# EAGLE schematic boilup_v2 (EAGLE 8.7.1)
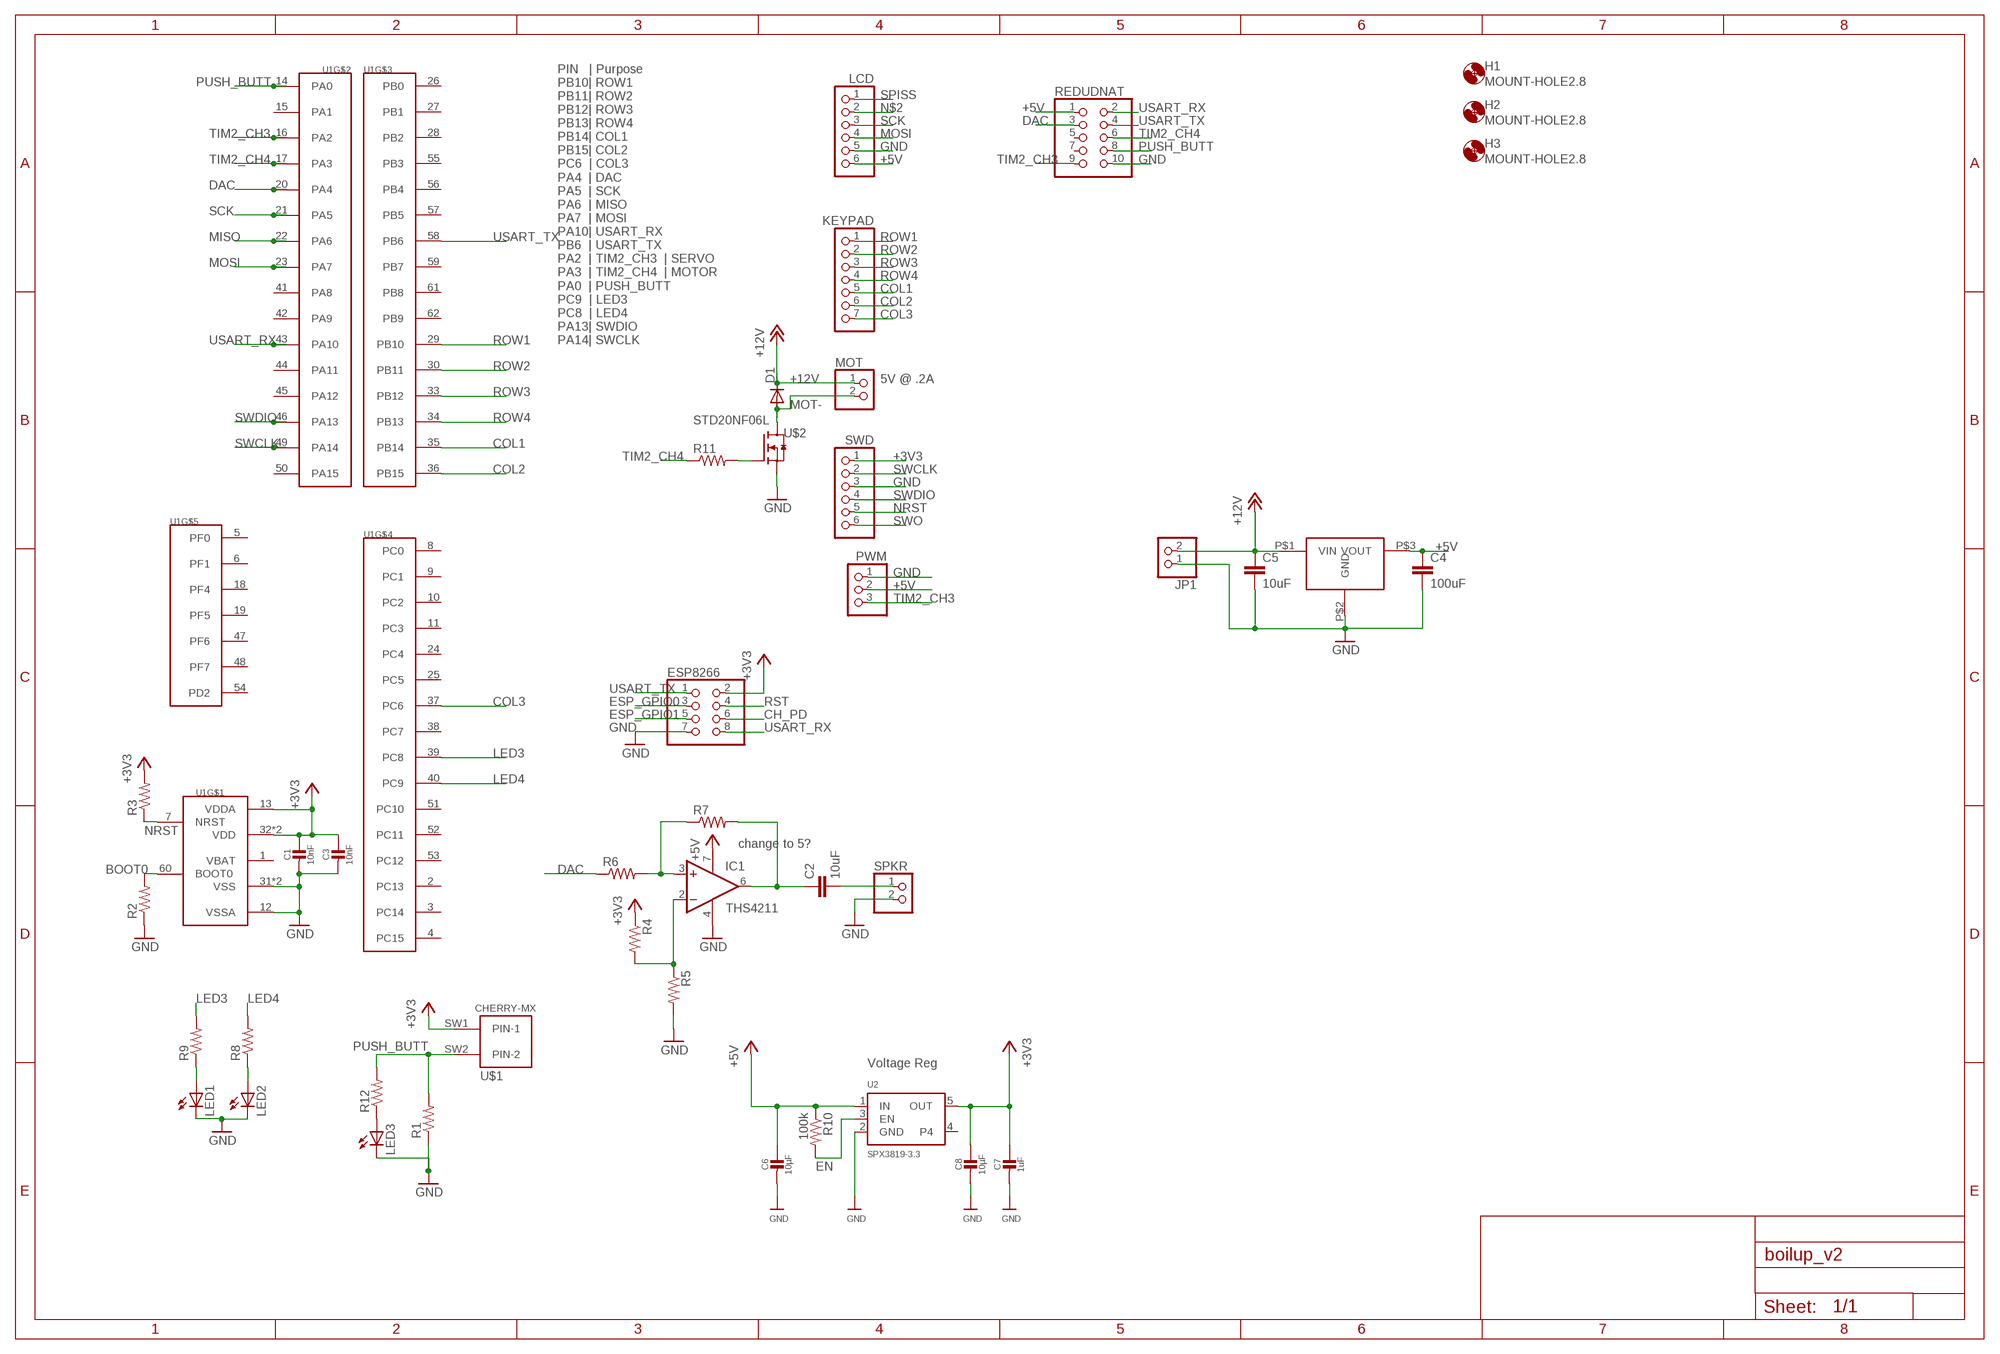
[diagram p0: schematic, sheet 1]

## Parts
C1  10nF  CAP_CERAMIC0805-NOOUTLINE  [0805-NO]
C2  10uF  C-EUC0603K  [C0603K]
C3  10nF  CAP_CERAMIC0805-NOOUTLINE  [0805-NO]
C4  100uF  C-EUC1210K  [C1210K]
C5  10uF  C-EUC0603K  [C0603K]
C6  10µF  CAP_CERAMIC0805-NOOUTLINE  [0805-NO]
C7  1uF  CAP_CERAMIC0603_NO  [0603-NO]
C8  10µF  CAP_CERAMIC0805-NOOUTLINE  [0805-NO]
D1  DIODE-DO-214AC  [DO-214AC]
ESP8266  PINHD-2X4  [2X04]
H1  MOUNT-HOLE2.8  [2,8]
H2  MOUNT-HOLE2.8  [2,8]
H3  MOUNT-HOLE2.8  [2,8]
IC1  THS4211  [S-PDSO-G08]
JP1  PINHD-1X2  [1X02]
KEYPAD  PINHD-1X7  [1X07]
LCD  PINHD-1X6  [1X06]
LED1  LEDSML0805  [SML0805]
LED2  LEDSML0805  [SML0805]
LED3  LEDSML0805  [SML0805]
MOT  PINHD-1X2  [1X02]
PWM  PINHD-1X3  [1X03]
R1  R-US_R0603  [R0603]
R2  R-US_R0603  [R0603]
R3  R-US_R0603  [R0603]
R4  R-US_R0603  [R0603]
R5  R-US_R0603  [R0603]
R6  R-US_R0603  [R0603]
R7  R-US_R0603  [R0603]
R8  R-US_R0603  [R0603]
R9  R-US_R0603  [R0603]
R10  100k  R-US_R0603  [R0603]
R11  R-US_R0603  [R0603]
R12  R-US_R0603  [R0603]
REDUDNAT  PINHD-2X5  [2X05]
SPKR  PINHD-1X2  [1X02]
SWD  PINHD-1X6  [1X06]
U1  STM32F0_LQFP64  [QFP50P1200X1200X160-64N]
U2  SPX3819-3.3  VREG_SOT23-5  [SOT23-5]
U$1  CHERRY-MX  [CHERRY-MX]
U$2  STD20NF06L  [DPAK]
U$3  TPSM842  [TO-220]

## Nets
+3V3: C1.1 C3.1 C7.1 C8.1 ESP8266.2 R3.2 R4.1 SWD.1 U1.13(VDDA) U1.32(VDD) U1.64(VDD) U2.5(OUT) U$1.SW1(PIN-1)
+5V: C4.1 C6.1 IC1.7(V+) LCD.6 PWM.2 R10.1 REDUDNAT.1 U2.1(IN) U$3.P$3(VOUT)
+12V: C5.1 D1.C JP1.2 MOT.1 U$3.P$1(VIN)
AMP: IC1.3(+IN) R6.2 R7.1
BOOT0: R2.2 U1.60(BOOT0)
CH_PD: ESP8266.6
COL1: KEYPAD.5 U1.35(PB14)
COL2: KEYPAD.6 U1.36(PB15)
COL3: KEYPAD.7 U1.37(PC6)
DAC: R6.1 REDUDNAT.3 U1.20(PA4)
EN: R10.2 U2.3(EN)
ESP_GPIO0: ESP8266.3
ESP_GPIO1: ESP8266.5
GND: C1.2 C3.2 C4.2 C5.2 C6.2 C7.2 C8.2 ESP8266.7 IC1.4(V-) JP1.1 LCD.5 LED1.C LED2.C LED3.C PWM.1 R1.1 R2.1 R5.2 REDUDNAT.10 SPKR.2 SWD.3 U1.12(VSSA) U1.31(VSS) U1.63(VSS) U2.2(GND) U$2.P$2(S) U$3.P$2(GND)
LED3: R9.2 U1.39(PC8)
LED4: R8.2 U1.40(PC9)
MISO: U1.22(PA6)
MOSI: LCD.4 U1.23(PA7)
MOT-: D1.A MOT.2 U$2.P$1(D)
N$1: LED2.A R8.1
N$2: LCD.2
N$3: LED1.A R9.1
N$4: R11.2 U$2.P$3(G)
N$5: LED3.A R12.1
N$7: IC1.2(-IN) R4.2 R5.1
N$16: C2.2 SPKR.1
N$17: C2.1 IC1.6(OUT) R7.2
NRST: R3.1 SWD.5 U1.7(NRST)
PUSH_BUTT: R1.2 R12.2 REDUDNAT.8 U1.14(PA0) U$1.SW2(PIN-2)
ROW1: KEYPAD.1 U1.29(PB10)
ROW2: KEYPAD.2 U1.30(PB11)
ROW3: KEYPAD.3 U1.33(PB12)
ROW4: KEYPAD.4 U1.34(PB13)
RST: ESP8266.4
SCK: LCD.3 U1.21(PA5)
SPISS: LCD.1
SWCLK: SWD.2 U1.49(PA14)
SWDIO: SWD.4 U1.46(PA13)
SWO: SWD.6
TIM2_CH3: PWM.3 REDUDNAT.9 U1.16(PA2)
TIM2_CH4: R11.1 REDUDNAT.6 U1.17(PA3)
USART_RX: ESP8266.8 REDUDNAT.2 U1.43(PA10)
USART_TX: ESP8266.1 REDUDNAT.4 U1.58(PB6)
Unconnected: IC1.TH REDUDNAT.5 REDUDNAT.7 U1.1(VBAT) U1.2(PC13) U1.3(PC14) U1.4(PC15) U1.5(PF0) U1.6(PF1) U1.8(PC0) U1.9(PC1) U1.10(PC2) U1.11(PC3) U1.15(PA1) U1.18(PF4) U1.19(PF5) U1.24(PC4) U1.25(PC5) U1.26(PB0) U1.27(PB1) U1.28(PB2) U1.38(PC7) U1.41(PA8) U1.42(PA9) U1.44(PA11) U1.45(PA12) U1.47(PF6) U1.48(PF7) U1.50(PA15) U1.51(PC10) U1.52(PC11) U1.53(PC12) U1.54(PD2) U1.55(PB3) U1.56(PB4) U1.57(PB5) U1.59(PB7) U1.61(PB8) U1.62(PB9) U2.4

## Notes on the sheet
- PIN   | Purpose
  PB10| ROW1
  PB11| ROW2
  PB12| ROW3
  PB13| ROW4
  PB14| COL1
  PB15| COL2
  PC6  | COL3
  PA4  | DAC
  PA5  | SCK
  PA6  | MISO
  PA7  | MOSI
  PA10| USART_RX
  PB6  | USART_TX
  PA2  | TIM2_CH3  | SERVO
  PA3  | TIM2_CH4  | MOTOR
  PA0  | PUSH_BUTT
  PC9  | LED3
  PC8  | LED4
  PA13| SWDIO
  PA14| SWCLK
- 5V @ .2A
- change to 5?
- Voltage Reg

## Library data of the parts
C1 C3 C6-C8 = microbuilder:CAP_CERAMIC: Ceramic Capacitors For new designs, use the packages preceded by an '_' character since they are more reliable: The following footprints should be used on most boards: _0402 - Standard footprint for regular board layouts _0603 - Standard footprint for regular board layouts _0805 - Standard footprint for regular board layouts _1206 - Standard footprint for regular board layouts For extremely tight-pitch boards where space is at a premium, the following 'micro-pitch' footprints can be used (smaller pads, no silkscreen outline, etc.): _0402MP - Micro-pitch footprint for very dense/compact boards _0603MP - Micro-pitch footprint for very dense/compact boards _0805MP - Micro-pitch footprint for very dense/compact boards _1206MP - Micro-pitch footprint for very dense/compact boards
C2 C4 C5 = resistor:C-EU: CAPACITOR, European symbol
D1 = diode:DIODE-: DIODE
ESP8266 = pinhead:PINHD-2X4: PIN HEADER
H1-H3 = holes:MOUNT-HOLE: MOUNTING HOLE with drill center marker
IC1 = texas:THS4211: LOW-DISTORTION, HIGH-SPEED, VOLTAGE FEEDBACK AMPLIFIER Source: http://focus.ti.com/lit/ds/symlink/ths4211.pdf; MF: TEXAS INSTRUMENT CONNECTORS; MPN: THS4211DGK; OC_FARNELL: 8453306; OC_NEWARK: 95H4489
JP1 MOT SPKR = pinhead:PINHD-1X2: PIN HEADER
KEYPAD = pinhead:PINHD-1X7: PIN HEADER
LCD SWD = pinhead:PINHD-1X6: PIN HEADER
LED1-LED3 = led:LED: LED OSRAM: - CHIPLED LG R971, LG N971, LY N971, LG Q971, LY Q971, LO R971, LY R971 LH N974, LH R974 LS Q976, LO Q976, LY Q976 LO Q996 - Hyper CHIPLED LW Q18S LB Q993, LB Q99A, LB R99A - SideLED LS A670, LO A670, LY A670, LG A670, LP A670 LB A673, LV A673, LT A673, LW A673 LH A674 LY A675 LS A676, LA A676, LO A676, LY A676, LW A676 LS A679, LY A679, LG A679 - Hyper Micro SIDELED® LS Y876, LA Y876, LO Y876, LY Y876 LT Y87S - SmartLED LW L88C, LW L88S LB L89C, LB L89S, LG L890 LS L89K, LO L89K, LY L89K LS L896, LA L896, LO L896, LY L896 - TOPLED LS T670, LO T670, LY T670, LG T670, LP T670 LSG T670, LSP T670, LSY T670, LOP T670, LYG T670 LG T671, LOG T671, LSG T671 LB T673, LV T673, LT T673, LW T673 LH T674 LS T676, LA T676, LO T676, LY T676, LB T676, LH T676, LSB T676, LW T676 LB T67C, LV T67C, LT T67C, LS T67K, LO T67K, LY T67K, LW E67C LS E67B, LA E67B, LO E67B, LY E67B, LB E67C, LV E67C, LT E67C LW T67C LS T679, LY T679, LG T679 LS T770, LO T770, LY T770, LG T770, LP T770 LB T773, LV T773, LT T773, LW T773 LH T774 LS E675, LA E675, LY E675, LS T675 LS T776, LA T776, LO T776, LY T776, LB T776 LHGB T686 LT T68C, LB T68C - Hyper Mini TOPLED® LB M676 - Mini TOPLED Santana® LG M470 LS M47K, LO M47K, LY M47K Source: http://www.osram.convergy.de LUXEON: - LUMILED® LXK2-PW12-R00, LXK2-PW12-S00, LXK2-PW14-U00, LXK2-PW14-V00 LXK2-PM12-R00, LXK2-PM12-S00, LXK2-PM14-U00 LXK2-PE12-Q00, LXK2-PE12-R00, LXK2-PE12-S00, LXK2-PE14-T00, LXK2-PE14-U00 LXK2-PB12-K00, LXK2-PB12-L00, LXK2-PB12-M00, LXK2-PB14-N00, LXK2-PB14-P00, LXK2-PB14-Q00 LXK2-PR12-L00, LXK2-PR12-M00, LXK2-PR14-Q00, LXK2-PR14-R00 LXK2-PD12-Q00, LXK2-PD12-R00, LXK2-PD12-S00 LXK2-PH12-R00, LXK2-PH12-S00 LXK2-PL12-P00, LXK2-PL12-Q00, LXK2-PL12-R00 Source: www.luxeon.com KINGBRIGHT: KA-3528ASYC Source: www.kingbright.com
PWM = pinhead:PINHD-1X3: PIN HEADER
R1-R9 R11 R12 = resistor:R-US_: RESISTOR, American symbol
R10 = adafruit:R-US_: RESISTOR, American symbol
REDUDNAT = pinhead:PINHD-2X5: PIN HEADER
U1 = smarttle:STM32F0_LQFP64
U2 = microbuilder:VREG_SOT23-5: SOT23-5 Fixed Voltage Regulators Part Current Out V Out V In V Dropout θJA (°C/W) TJ (°C) Digikey Part No. ADP121 150mA 3.3V 3.4-5.5V 0.09V @ 150mA -- -- ADP121-AUJZ33R7CT-ND ADP121 150mA 3.0V 3.1-5.5V 0.09V @ 150mA -- -- ADP121-AUJZ30R7CT-ND ADP122 300mA 3.3V 3.4-5.5V 0.085V @ 300mA -- -- ADP122AUJZ-3.3-R7CT-ND ADP1712 300mA 3.3V 3.5-5.5V 0.17V @ 300mA -- -- ADP1712AUJZ-3.3-R7TR-ND AP7311 (Low Cost) 150mA 3.3V 3.5-6V 0.15V @ 150mA -- -- AP7311-33WG-7DICT-ND LD39015M18R 150mA 1.8V 1.9V-5.5V 0.08V @ 100mA -- -- 497-6977-1-ND LP2985A-33DBVR 150mA 3.3V 3.3-16V 0.28V @ 150mA 206 150 296-18479-1-ND MCP1824T-3302E/OT 300mA 3.3V 3.5V-6V 0.2V @ 300mA -- -- MCP1824T-3302E/OTCT-ND MIC5205-2.5YM5 TR 150mA 2.5V 2.7-16V 0.165V @ 150mA -- -- 576-1257-2-ND MIC5205-3.0YM5 TR 150mA 3.0V 3.2V-16V 0.165V @ 150mA -- -- 576-1258-2-ND MIC5205-3.3YM5 TR 150mA 3.3V 3.5V-16V 0.165V @ 150mA -- -- 576-1259-2-ND TPS780330220 150mA 3.3V+2.2V 3.6-5.5V 250mV Max -- -- 296-23332-1-ND TDA3663/N1,135 100mA 3.3V 3.5-45V 0.18V @ 50mA -- -- 568-5343-1-ND Max operating temp can be calculated using θJA, TJ (max junction temperature), and power in watts. Set the "Maximum Ambient Temperature" until it reaches TJ ("Max Junction Temperature"), which is the absolute limit for safe use of the regulator: Heat Sink Temperature Calculator <http://www.daycounter.com/Calculators/Heat-Sink-Temperature-Calculator.phtml> For example, With 12V source into a 3.3V LP2985 and a 30mA load, we are dissipating (12V-3.3V) * 0.03A = 0.261W. With a θJA of 206 °C/W, a TJ of 150°C, and 261mW we can safely use the chip without a heat sink up to 75°C (=147.1°C Junction Temperature).
U$1 = cherrymx:CHERRY-MX: Cherry MX series keyswitch
U$2 = smarttle:STD20NF06L
U$3 = smarttle:TPSM842